# EAGLE design esp-carrier (EAGLE 9.0.1)
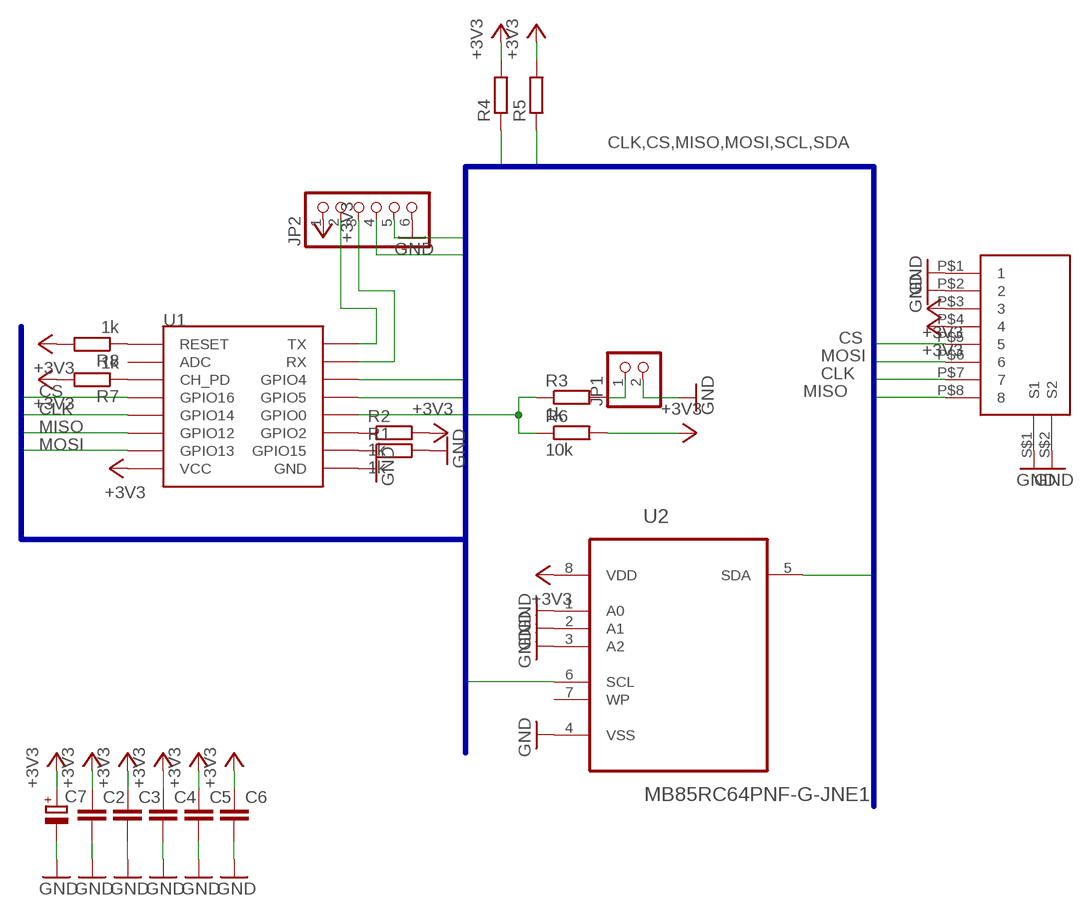
[diagram p0: schematic, sheet 1]

## Parts
C1  RJ45-ASSMANN  [RJ45-ASSMANN]
C2  C-EUC0805  [C0805]
C3  C-EUC0805  [C0805]
C4  C-EUC0805  [C0805]
C5  C-EUC0805  [C0805]
C6  C-EUC0805  [C0805]
C7  CPOL-EUF  [PANASONIC_F]
JP1  PINHD-1X2  [1X02]
JP2  PINHD-1X6  [1X06]
R1  1k  R-EU_R0805  [R0805]
R2  1k  R-EU_R0805  [R0805]
R3  1k  R-EU_R0805  [R0805]
R4  R-EU_R0805  [R0805]
R5  R-EU_R0805  [R0805]
R6  10k  R-EU_R0805  [R0805]
R7  1k  R-EU_R0805  [R0805]
R8  1k  R-EU_R0805  [R0805]
U1  ESP12SMD  [ESP12-SMD]
U2  MB85RC64PNF-G-JNE1  [SOIC127P600X175-8N]

## Nets
+3V3: C1.P$3 C1.P$4 C2.1 C3.1 C4.1 C5.1 C6.1 C7.+ JP2.1 R2.2 R4.2 R5.2 R6.2 R7.2 R8.2 U1.VCC U2.8(VDD)
CLK: C1.P$7 U1.GPIO14
CS: C1.P$5 U1.GPIO16
GND: C1.P$1 C1.P$2 C1.S$1(S1) C1.S$2(S2) C2.2 C3.2 C4.2 C5.2 C6.2 C7.- JP1.2 JP2.6 R1.2 U1.GND U2.1(A0) U2.2(A1) U2.3(A2) U2.4(VSS)
MISO: C1.P$8 U1.GPIO12
MOSI: C1.P$6 U1.GPIO13
N$1: R1.1 U1.GPIO15
N$2: R2.1 U1.GPIO2
N$3: R3.1 R6.1 U1.GPIO0
N$4: JP1.1 R3.2
N$5: JP2.2 U1.TXD0(TX)
N$6: R7.1 U1.CH_PD
N$7: JP2.3 U1.RXD0(RX)
N$8: R8.1 U1.RESET
SCL: JP2.5 R4.1 U1.GPIO5 U2.6(SCL)
SDA: JP2.4 R5.1 U1.GPIO4 U2.5(SDA)
Unconnected: U1.ADC U2.7(WP)

## Buses
CLK,CS,MISO,MOSI,SCL,SDA

## Library data of the parts
C1 = rj45:RJ45-ASSMANN
C2-C6 = rcl:C-EU: CAPACITOR, European symbol; SPICEPREFIX: C
C7 = rcl:CPOL-EU: POLARIZED CAPACITOR, European symbol; SPICEPREFIX: C
JP1 = pinhead:PINHD-1X2: PIN HEADER
JP2 = pinhead:PINHD-1X6: PIN HEADER
R1-R8 = rcl:R-EU_: RESISTOR, European symbol; SPICEPREFIX: R
U1 = esp8266modules:ESP12: ESP8266 Wifi module 12
U2 = Fujitsu_By_element14_Batch_1:MB85RC64PNF-G-JNE1: Memory FRAM; MPN: MB85RC64PNF-G-JNE1; OC_FARNELL: 1831994; OC_NEWARK: 93R5162; PACKAGE: SO-8; SUPPLIER: FUJITSU

## Board
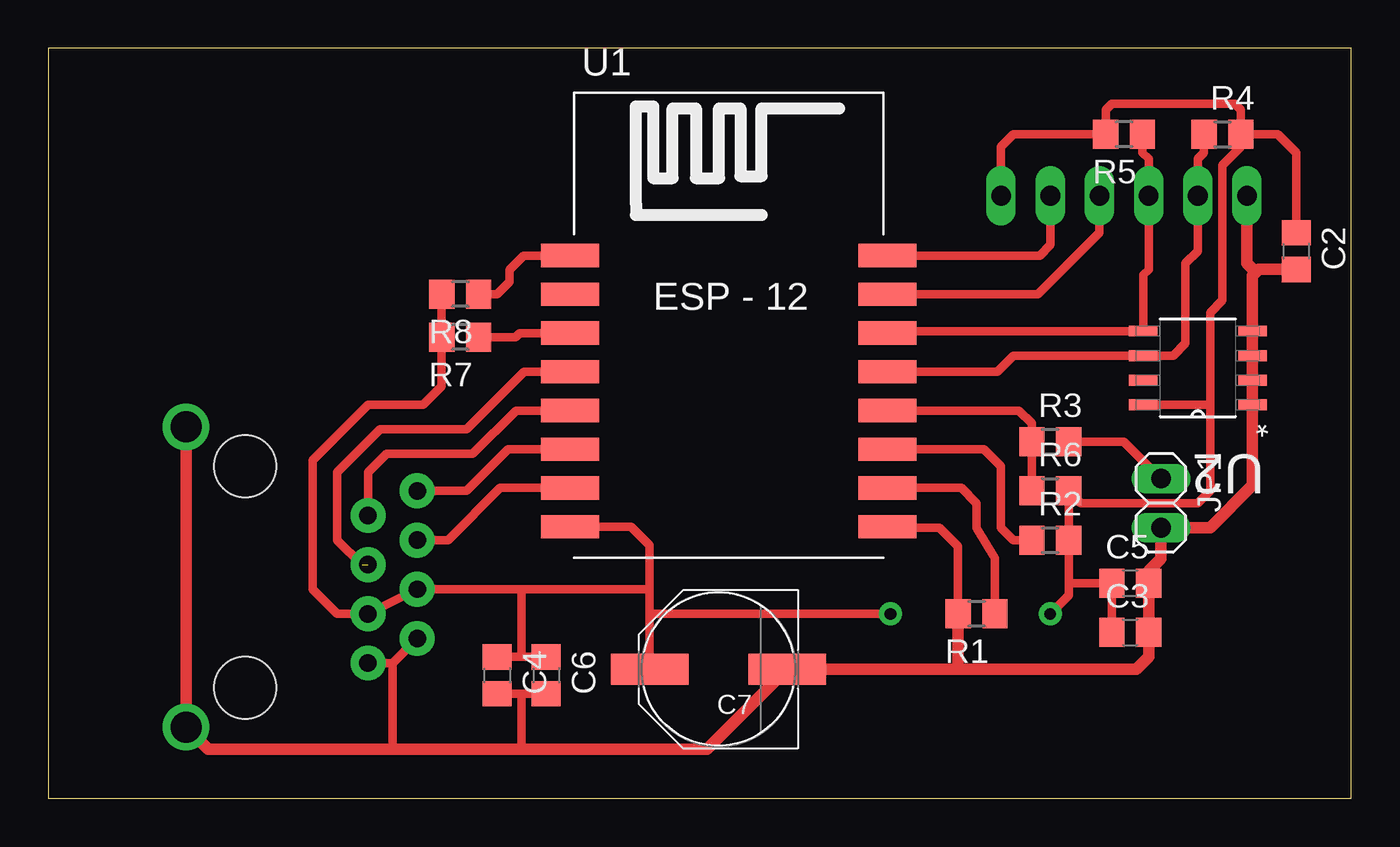
[diagram p1: board, top side]
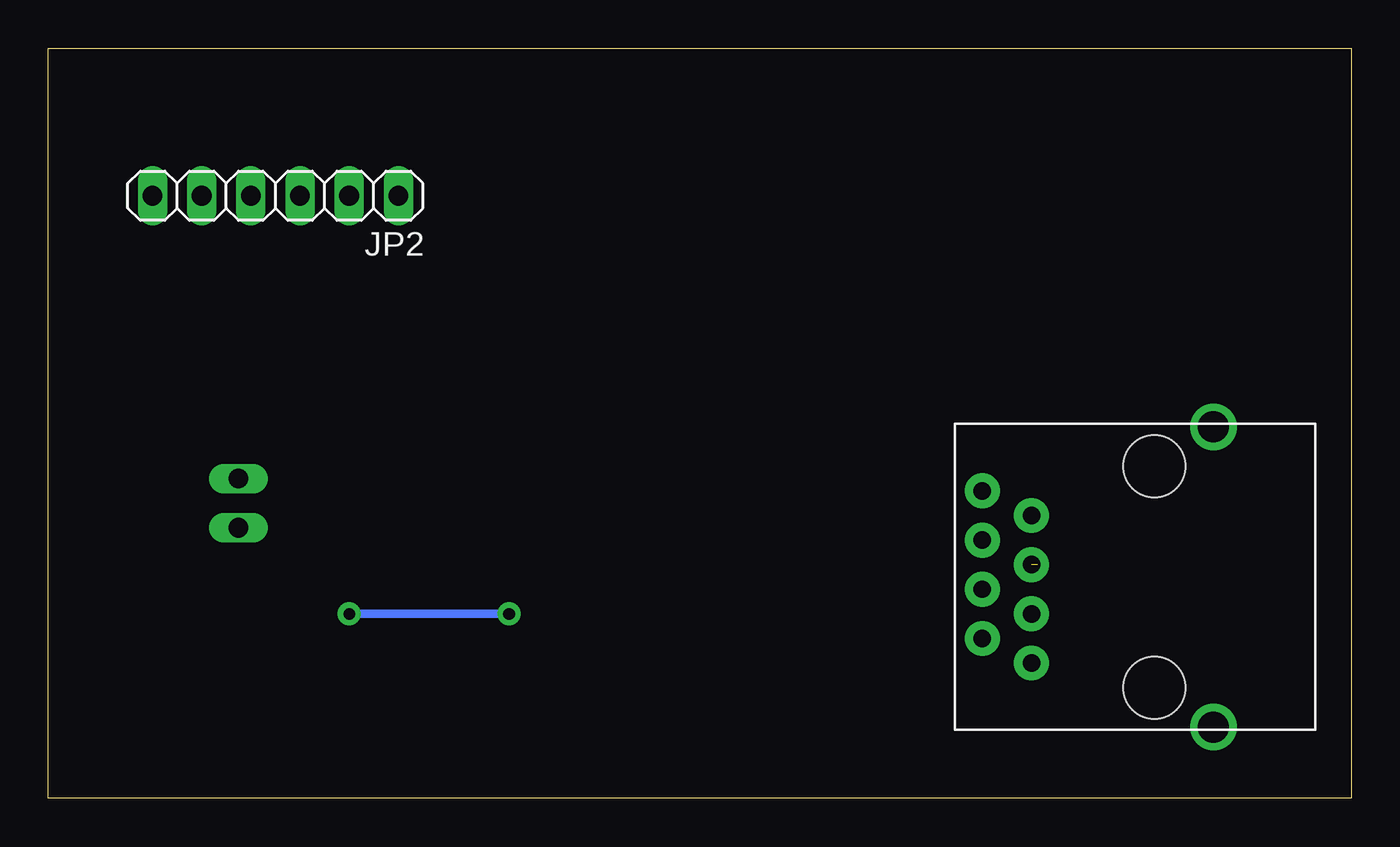
[diagram p2: board, bottom side, seen from below]

Size 67.29 x 38.72 mm. Coordinates in mm from the lower left corner, seen from the top.
Outline: 0,0 67.29,0 67.29,38.72 0,38.72 0,0
Copper layers (1*16): Top 0.035mm / dielectric 1.5mm / Bottom 0.035mm
Design rules "default": minimum track width 6mil, minimum drill 0.35mm, track to track 6mil, track to pad 6mil, pad to pad 6mil, via to via 6mil, smd to smd 6mil, copper to edge 40mil, drill to drill 6mil, minimum pad ring 10mil, minimum via ring 8mil, stop-mask expansion 4mil, vias tented up to drill 0mil, thermal gap 10mil

### Footprints (pad centres in the part's own frame; a part is rotated, then mirrored left to right if it is on the bottom)
RJ45-ASSMANN = drill 0.9 pad 1.8: P$1 -4.445,6.35; P$2 -3.175,8.89; P$3 -1.905,6.35; P$4 -0.635,8.89; P$5 0.635,6.35; P$6 1.905,8.89; P$7 3.175,6.35; P$8 4.445,8.89 | drill 1.6: S$1 -7.75,-3.05; S$2 7.75,-3.05 | hole 3.2: -5.715,0; 5.715,0
C0805 = smd 1.3 x 1.5: 1 -0.95,0; 2 0.95,0
PANASONIC_F = smd 4 x 1.6: + 3.55,0; - -3.55,0
1X02 = drill 1.016 long: 1 -1.27,0; 2 1.27,0
1X06 = drill 1.016 long: 1 -6.35,0; 2 -3.81,0; 3 -1.27,0; 4 1.27,0; 5 3.81,0; 6 6.35,0
R0805 = smd 1.3 x 1.5: 1 -0.95,0; 2 0.95,0
ESP12-SMD = smd 3 x 1.2: ADC -8.3,3.8; CH_PD -8.3,1.8; GND 8.1,-8.2; GPIO0 8.1,-2.2; GPIO2 8.1,-4.2; GPIO4 8.1,1.8; GPIO5 8.1,-0.2; GPIO12 -8.3,-4.2; GPIO13 -8.3,-6.2; GPIO14 -8.3,-2.2; GPIO15 8.1,-6.2; GPIO16 -8.3,-0.2; RESET -8.3,5.8; RXD0 8.1,3.8; TXD0 8.1,5.8; VCC -8.3,-8.2
SOIC127P600X175-8N = smd 1.473 x 0.559: 1 -2.819,1.905; 2 -2.819,0.635; 3 -2.819,-0.635; 4 -2.819,-1.905; 5 2.819,-1.905; 6 2.819,-0.635; 7 2.819,0.635; 8 2.819,1.905

### Placement (x,y rotation side)
C1  10.16,11.43 90 bottom
C2  64.45,28.26 270 top
C3  55.88,8.57 0 top
C4  23.18,6.35 270 top
C5  55.88,11.11 0 top
C6  25.72,6.35 270 top
C7  34.61,6.67 180 top
JP1  57.47,15.24 270 top
JP2  55.56,31.11 180 bottom
R1  47.94,9.53 180 top
R2  51.75,13.34 0 top
R3  51.75,18.41 0 top
R4  60.64,34.29 0 top
R5  55.56,34.29 180 top
R6  51.75,15.88 0 top
R7  21.27,23.81 180 top
R8  21.27,26.04 180 top
U1  35.24,22.23 0 top
U2  59.37,22.23 180 top

### Tracks (layer width: path | path; a pad name or v marks a point on that pad's centre or on a via)
+3V3  (via drill 0.6 pad 1.2)
  Top 0.45: R2.2 R6.2 53.34,15.24 59.37,15.24 60.01,15.88 60.01,20.32 | JP2.1 49.21,33.66 49.85,34.29 R5.2 54.61,35.56 54.93,35.88 61.28,35.88 61.59,35.56 R4.2 | R4.2 61.59,33.66 60.64,32.7 60.64,25.72 60.01,25.08 60.01,20.32 | R4.2 63.5,34.29 64.45,33.34 C2.1 | U1.VCC 30.11,14.03 31.06,13.07 31.06,10.79 | 31.06,10.79 31.06,9.53 | 31.06,9.53 C7.+ | R2.2 | U2.8 60.01,20.32 | v43.5,9.53 31.06,9.53 | 24.45,10.79 C1.P$4 C1.P$3 14.92,9.53 13.65,10.79 13.65,17.46 16.51,20.32 19.37,20.32 20.32,21.27 R7.2 R8.2 | 24.45,10.79 31.06,10.79 | C4.1 24.45,7.3 | 24.45,7.3 C6.1 | 24.45,7.3 24.45,10.79 | C3.1 C5.1 52.7,11.11 | v51.75,9.53 52.7,10.47 52.7,11.11 | 52.7,11.11 R2.2
  Bottom 0.45: v51.75,9.53 v43.5,9.53
CLK
  Top 0.45: U1.GPIO14 24.15,20.02 21.91,17.78 17.46,17.78 16.51,16.83 C1.P$7
CS  (1 unrouted)
  Top 0.45: U1.GPIO16 24.57,22.02 21.59,19.05 17.14,19.05 14.92,16.83 14.92,13.34 16.19,12.06
GND
  Top 0.45: R1.2 46.99,13.02 46.04,13.97 43.4,13.97 U1.GND 43.29,13.97 | 62.19,26.99 62.19,27.34 | C1.P$2 17.78,6.99 | 17.78,6.99 C1.P$1 | 17.78,6.99 17.78,2.54 | C4.2 24.45,5.4 | 24.45,5.4 C6.2 | 24.45,5.4 24.45,2.54
  Top 0.6: 62.19,27.34 61.91,27.62 JP2.6 | C2.2 62.51,27.31 62.19,26.99 U2.4 U2.3 U2.2 U2.1 62.19,16.15 60.01,13.97 JP1.2 57.47,12.38 56.83,11.74 C5.2 C3.2 56.83,7.94 56.83,7.3 56.2,6.67 46.99,6.67 | R1.2 46.99,6.67 | C1.S$2 C1.S$1 8.25,2.54 17.78,2.54 24.45,2.54 34.03,2.54 C7.- 46.99,6.67
MISO
  Top 0.45: U1.GPIO12 23.74,18.02 21.59,15.88 C1.P$8
MOSI
  Top 0.45: U1.GPIO13 23.33,16.02 20.64,13.34 C1.P$6
N$1
  Top 0.45: U1.GPIO15 47.16,16.02 47.94,15.24 47.94,13.97 48.89,12.38 R1.1
N$2
  Top 0.45: R2.1 49.85,13.34 49.21,13.97 49.21,17.14 48.33,18.02 U1.GPIO2
N$3
  Top 0.45: U1.GPIO0 50.14,20.02 50.8,19.36 R3.1 R6.1
N$4
  Top 0.45: R3.2 55.56,18.41 JP1.1
N$5
  Top 0.45: U1.TXD0 51.2,28.02 51.75,28.57 JP2.2
N$6
  Top 0.45: U1.CH_PD 24.34,24.02 24.13,23.81 R7.1
N$7
  Top 0.45: U1.RXD0 51.11,26.02 54.29,29.21 JP2.3
N$8
  Top 0.45: U1.RESET 24.53,28.02 23.81,27.3 23.81,26.67 23.18,26.04 R8.1
SCL
  Top 0.45: U1.GPIO5 49.01,22.02 49.85,22.86 U2.6 58.1,22.86 58.74,23.5 58.74,27.62 59.37,28.26 JP2.5 59.37,33.02 59.69,33.34 R4.1
SDA
  Top 0.45: U1.GPIO4 43.45,24.13 U2.5 56.55,27.03 56.83,27.3 JP2.4 56.83,33.02 56.51,33.34 R5.1